# EAGLE design PGTNX02_vca (EAGLE 8.5.2)
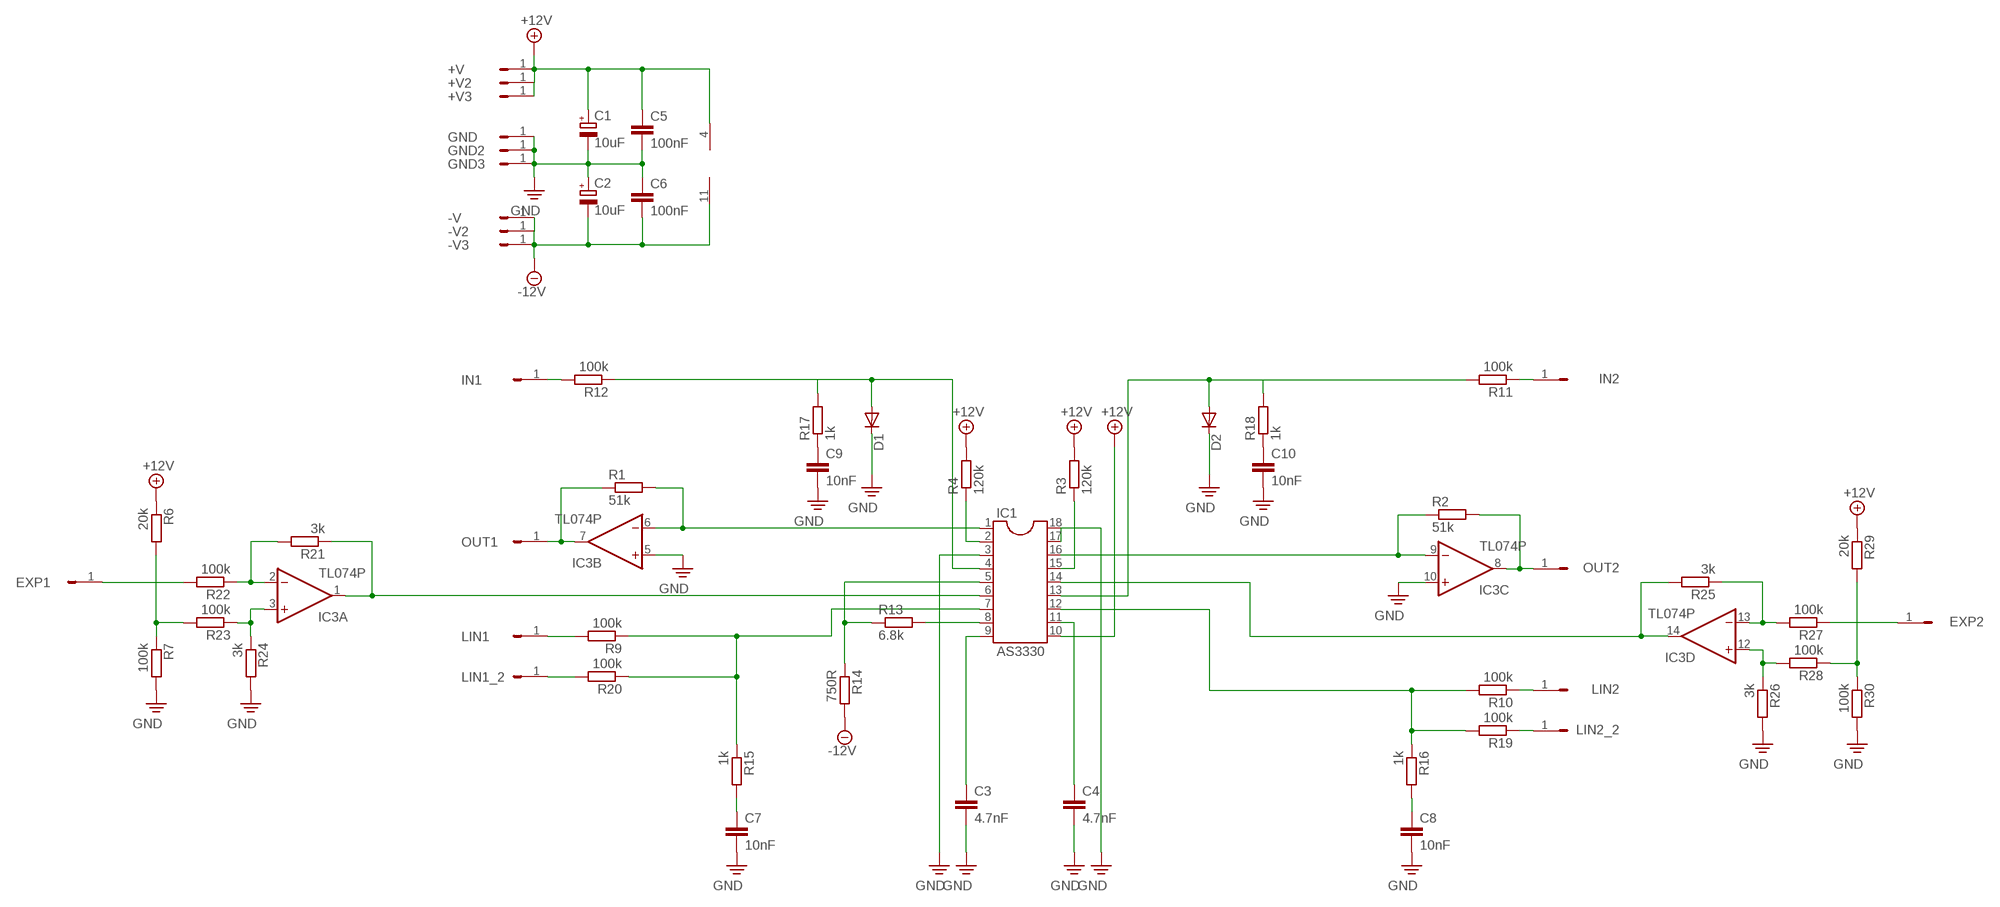
[diagram p0: schematic, sheet 1]

## Parts
+V  HEADER/MALE/01  [HEADER/MALE/01]
+V2  HEADER/MALE/01  [HEADER/MALE/01]
+V3  HEADER/MALE/01  [HEADER/MALE/01]
-V  HEADER/MALE/01  [HEADER/MALE/01]
-V2  HEADER/MALE/01  [HEADER/MALE/01]
-V3  HEADER/MALE/01  [HEADER/MALE/01]
C1  10uF  CAPACITOR/POLARIZEDE2.5-6  [E2,5-6]
C2  10uF  CAPACITOR/POLARIZEDE2.5-6  [E2,5-6]
C3  4.7nF  CAPACITORCERAMICDISC/5  [CERAMICDISC/5]
C4  4.7nF  CAPACITORCERAMICDISC/5  [CERAMICDISC/5]
C5  100nF  CAPACITORCERAMICDISC/5  [CERAMICDISC/5]
C6  100nF  CAPACITORCERAMICDISC/5  [CERAMICDISC/5]
C7  10nF  CAPACITORCERAMICDISC/5  [CERAMICDISC/5]
C8  10nF  CAPACITORCERAMICDISC/5  [CERAMICDISC/5]
C9  10nF  CAPACITORCERAMICDISC/5  [CERAMICDISC/5]
C10  10nF  CAPACITORCERAMICDISC/5  [CERAMICDISC/5]
D1  1N4148DO35-7  [DO35-7]
D2  1N4148DO35-7  [DO35-7]
EXP1  HEADER/MALE/01  [HEADER/MALE/01]
EXP2  HEADER/MALE/01  [HEADER/MALE/01]
GND  HEADER/MALE/01  [HEADER/MALE/01]
GND2  HEADER/MALE/01  [HEADER/MALE/01]
GND3  HEADER/MALE/01  [HEADER/MALE/01]
IC1  AS3330  DIL18  [DIL18]
IC3  TL074P  [DIL14]
IN1  HEADER/MALE/01  [HEADER/MALE/01]
IN2  HEADER/MALE/01  [HEADER/MALE/01]
LIN1  HEADER/MALE/01  [HEADER/MALE/01]
LIN1_2  HEADER/MALE/01  [HEADER/MALE/01]
LIN2  HEADER/MALE/01  [HEADER/MALE/01]
LIN2_2  HEADER/MALE/01  [HEADER/MALE/01]
OUT1  HEADER/MALE/01  [HEADER/MALE/01]
OUT2  HEADER/MALE/01  [HEADER/MALE/01]
R1  51k  RESISTORRESISTOR/UPRIGHT/7.5  [RESISTOR/7.5]
R2  51k  RESISTORRESISTOR/UPRIGHT/7.5  [RESISTOR/7.5]
R3  120k  RESISTORRESISTOR/UPRIGHT/7.5  [RESISTOR/7.5]
R4  120k  RESISTORRESISTOR/UPRIGHT/7.5  [RESISTOR/7.5]
R6  20k  RESISTORRESISTOR/UPRIGHT/7.5  [RESISTOR/7.5]
R7  100k  RESISTORRESISTOR/UPRIGHT/7.5  [RESISTOR/7.5]
R9  100k  RESISTORRESISTOR/UPRIGHT/7.5  [RESISTOR/7.5]
R10  100k  RESISTORRESISTOR/UPRIGHT/7.5  [RESISTOR/7.5]
R11  100k  RESISTORRESISTOR/UPRIGHT/7.5  [RESISTOR/7.5]
R12  100k  RESISTORRESISTOR/UPRIGHT/7.5  [RESISTOR/7.5]
R13  6.8k  RESISTORRESISTOR/UPRIGHT/7.5  [RESISTOR/7.5]
R14  750R  RESISTORRESISTOR/UPRIGHT/7.5  [RESISTOR/7.5]
R15  1k  RESISTORRESISTOR/UPRIGHT/7.5  [RESISTOR/7.5]
R16  1k  RESISTORRESISTOR/UPRIGHT/7.5  [RESISTOR/7.5]
R17  1k  RESISTORRESISTOR/UPRIGHT/7.5  [RESISTOR/7.5]
R18  1k  RESISTORRESISTOR/UPRIGHT/7.5  [RESISTOR/7.5]
R19  100k  RESISTORRESISTOR/UPRIGHT/7.5  [RESISTOR/7.5]
R20  100k  RESISTORRESISTOR/UPRIGHT/7.5  [RESISTOR/7.5]
R21  3k  RESISTORRESISTOR/UPRIGHT/7.5  [RESISTOR/7.5]
R22  100k  RESISTORRESISTOR/UPRIGHT/7.5  [RESISTOR/7.5]
R23  100k  RESISTORRESISTOR/UPRIGHT/7.5  [RESISTOR/7.5]
R24  3k  RESISTORRESISTOR/UPRIGHT/7.5  [RESISTOR/7.5]
R25  3k  RESISTORRESISTOR/UPRIGHT/7.5  [RESISTOR/7.5]
R26  3k  RESISTORRESISTOR/UPRIGHT/7.5  [RESISTOR/7.5]
R27  100k  RESISTORRESISTOR/UPRIGHT/7.5  [RESISTOR/7.5]
R28  100k  RESISTORRESISTOR/UPRIGHT/7.5  [RESISTOR/7.5]
R29  20k  RESISTORRESISTOR/UPRIGHT/7.5  [RESISTOR/7.5]
R30  100k  RESISTORRESISTOR/UPRIGHT/7.5  [RESISTOR/7.5]

## Nets
+12V: +V2.1 +V3.1 +V.1 C1.+ C5.1 IC1.10 IC3.4(P:V+) R3.2 R4.2 R6.1 R29.1
-12V: -V2.1 -V3.1 -V.1 C2.- C6.2 IC3.11(P:V-) R14.2
N$1: IC1.1 IC3.6(B:-IN) R1.2
N$2: IC3.7(B:OUT) OUT1.1 R1.1
N$3: IC1.16 IC3.9(C:-IN) R2.1
N$4: IC3.8(C:OUT) OUT2.1 R2.2
N$5: C4.1 IC1.11
N$6: IC1.15 R3.1
N$7: IC1.2 R4.1
N$8: C3.1 IC1.9
N$9: IC1.14 IC3.14(D:OUT) R25.2
N$10: IC1.6 IC3.1(A:OUT) R21.1
N$11: EXP1.1 R22.2
N$12: EXP2.1 R27.1
N$13: IC1.7 R9.1 R15.1 R20.1
N$14: IC1.12 R10.2 R16.1 R19.2
N$15: LIN2.1 R10.1
N$16: LIN1.1 R9.2
N$17: D2.A IC1.13 R11.2 R18.2
N$18: D1.A IC1.4 R12.1 R17.2
N$19: IN1.1 R12.2
N$20: IN2.1 R11.1
N$21: IC1.5 R13.1 R14.1
N$22: IC1.8 R13.2
N$23: C7.1 R15.2
N$24: C8.1 R16.2
N$25: C9.1 R17.1
N$26: C10.1 R18.1
N$27: LIN1_2.1 R20.2
N$28: LIN2_2.1 R19.1
N$29: R6.2 R7.1 R23.2
N$30: IC3.2(A:-IN) R21.2 R22.1
N$31: IC3.3(A:+IN) R23.1 R24.1
N$32: IC3.13(D:-IN) R25.1 R27.2
N$34: IC3.12(D:+IN) R26.1 R28.2
N$35: R28.1 R29.2 R30.1
PE: C1.- C2.+ C3.2 C4.2 C5.2 C6.1 C7.2 C8.2 C9.2 C10.2 D1.C D2.C GND2.1 GND3.1 GND.1 IC1.3 IC1.17 IC1.18 IC3.5(B:+IN) IC3.10(C:+IN) R7.2 R24.2 R26.2 R30.2 ; supply symbol labelled GND

## Library data of the parts
+V +V2 +V3 -V -V2 -V3 GND GND2 GND3 = connectors:HEADER/MALE/01; SPICEPREFIX: X
C1 C2 = capacitors:CAPACITOR/POLARIZED: POLARIZED CAPACITOR, European symbol; SPICEPREFIX: C
C3-C10 = capacitors:CAPACITOR: CAPACITOR, European symbol
D1 D2 = transistors:1N4148: DIODE high speed (Philips)
EXP1 EXP2 IN1 IN2 LIN1 LIN1_2 LIN2 LIN2_2 OUT1 OUT2 = connectors:HEADER/MALE/01
IC1 = ic_package:DIL18: Dual In Line / Socket
IC3 = ic_analogue:TL074: OP AMP
R1-R4 R6 R7 R9-R30 = resistors:RESISTOR: RESISTOR, European symbol

## Board
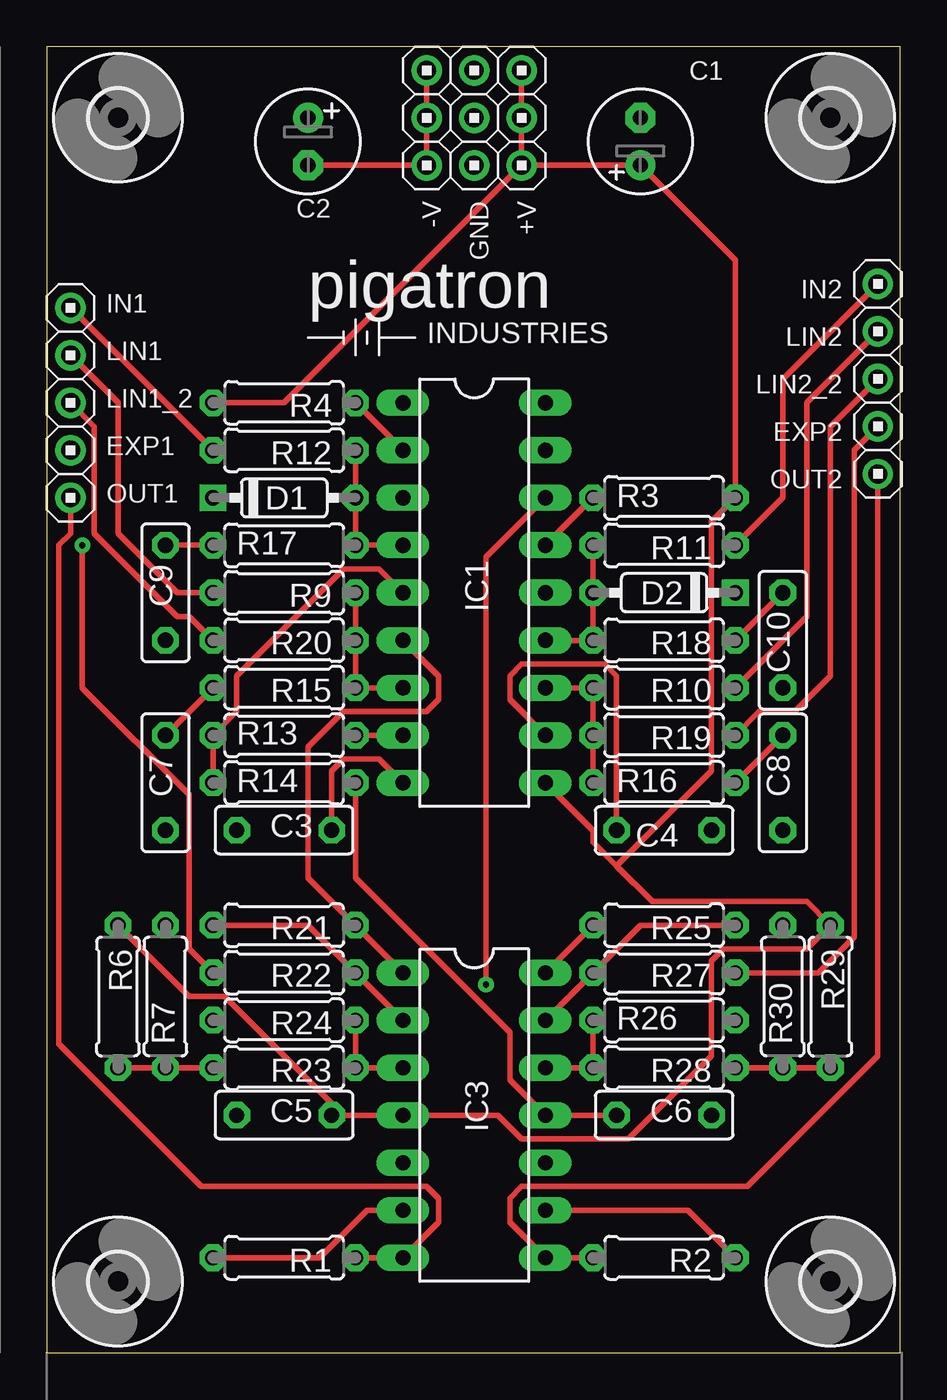
[diagram p1: board, top side]
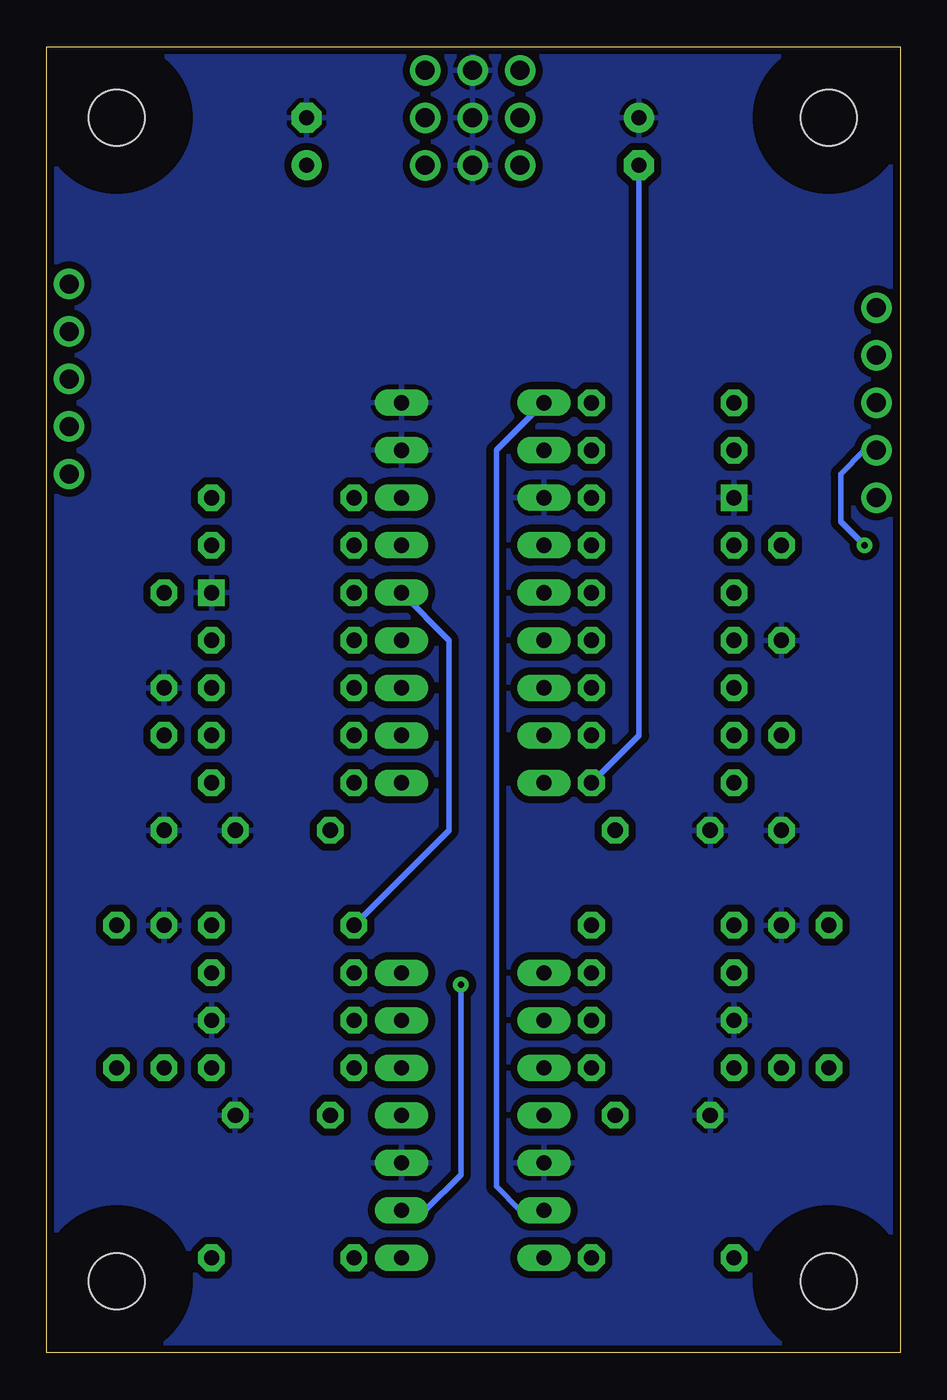
[diagram p2: board, bottom side, seen from below]

Size 45.64 x 69.84 mm. Coordinates in mm from the lower left corner, seen from the top.
Outline: 0,0 45.64,0 45.64,69.84 0,69.84 0,0
Copper layers (1*16): Top 0.0356mm / dielectric 1.5011mm / Bottom 0.0356mm
Design rules "pigatron": minimum track width 12mil, minimum drill 13mil, track to track 15mil, track to pad 10mil, pad to pad 10mil, via to via 10mil, smd to smd 6mil, copper to edge 15mil, drill to drill 10mil, minimum pad ring 12mil, minimum via ring 10mil, stop-mask expansion 4mil, vias tented up to drill 0mil, thermal gap 10mil

### Footprints (pad centres in the part's own frame; a part is rotated, then mirrored left to right if it is on the bottom)
HEADER/MALE/01 = drill 1.016: 1 0,0
E2,5-6 = drill 0.813 pad 1.6: + -1.27,0 | drill 0.813 pad 1.6 octagon: - 1.27,0
CERAMICDISC/5 = drill 0.813 octagon: 1 -2.54,0; 2 2.54,0
DO35-7 = drill 0.813 octagon: A 3.81,0 | drill 0.813 square: C -3.81,0
DIL18 = drill 0.813 long: 1 -10.16,-3.81; 2 -7.62,-3.81; 3 -5.08,-3.81; 4 -2.54,-3.81; 5 0,-3.81; 6 2.54,-3.81; 7 5.08,-3.81; 8 7.62,-3.81; 9 10.16,-3.81; 10 10.16,3.81; 11 7.62,3.81; 12 5.08,3.81; 13 2.54,3.81; 14 0,3.81; 15 -2.54,3.81; 16 -5.08,3.81; 17 -7.62,3.81; 18 -10.16,3.81
DIL14 = drill 0.813 long: 1 -7.62,-3.81; 2 -5.08,-3.81; 3 -2.54,-3.81; 4 0,-3.81; 5 2.54,-3.81; 6 5.08,-3.81; 7 7.62,-3.81; 8 7.62,3.81; 9 5.08,3.81; 10 2.54,3.81; 11 0,3.81; 12 -2.54,3.81; 13 -5.08,3.81; 14 -7.62,3.81
RESISTOR/7.5 = drill 0.813 octagon: 1 -3.81,0; 2 3.81,0
STANDOFF/3.0 = hole 3: 0,0

### Placement (x,y rotation side)
+V  25.4,63.5 270 top
+V2  25.4,66.04 270 top
+V3  25.4,68.58 270 top
-V  20.32,63.5 270 top
-V2  20.32,66.04 270 top
-V3  20.32,68.58 270 top
C1  31.75,64.77 90 top
C2  13.97,64.77 270 top
C3  12.7,27.94 180 top
C4  33.02,27.94 0 top
C5  12.7,12.7 180 top
C6  33.02,12.7 180 top
C7  6.35,30.48 270 top
C8  39.37,30.48 270 top
C9  6.35,40.64 270 top
C10  39.37,38.1 270 top
D1  12.7,45.72 0 top
D2  33.02,40.64 180 top
EXP1  1.27,48.26 0 top
EXP2  44.45,49.53 180 top
GND  22.86,63.5 270 top
GND2  22.86,68.58 270 top
GND3  22.86,66.04 270 top
IC1  22.86,40.64 270 top
IC3  22.86,12.7 270 top
IN1  1.27,55.88 0 top
IN2  44.45,57.15 180 top
LIN1  1.27,53.34 0 top
LIN1_2  1.27,50.8 0 top
LIN2  44.45,54.61 180 top
LIN2_2  44.45,52.07 180 top
OUT1  1.27,45.72 0 top
OUT2  44.45,46.99 180 top
R1  12.7,5.08 180 top
R2  33.02,5.08 180 top
R3  33.02,45.72 0 top
R4  12.7,50.8 180 top
R6  3.81,19.05 270 top
R7  6.35,19.05 90 top
R9  12.7,40.64 180 top
R10  33.02,35.56 180 top
R11  33.02,43.18 180 top
R12  12.7,48.26 180 top
R13  12.7,33.02 0 top
R14  12.7,30.48 0 top
R15  12.7,35.56 180 top
R16  33.02,30.48 0 top
R17  12.7,43.18 0 top
R18  33.02,38.1 180 top
R19  33.02,33.02 180 top
R20  12.7,38.1 180 top
R21  12.7,22.86 180 top
R22  12.7,20.32 180 top
R23  12.7,15.24 180 top
R24  12.7,17.78 180 top
R25  33.02,22.86 180 top
R26  33.02,17.78 0 top
R27  33.02,20.32 180 top
R28  33.02,15.24 180 top
R29  41.91,19.05 270 top
R30  39.37,19.05 90 top
U$1  [STANDOFF/3.0]  3.81,3.81 0 top
U$2  [STANDOFF/3.0]  41.91,3.81 0 top
U$3  [STANDOFF/3.0]  3.81,66.04 0 top
U$4  [STANDOFF/3.0]  41.91,66.04 0 top
U$5  [PIGATRON-LOGO]  22.86,55.88 0 top

### Tracks (layer width: path | path; a pad name or v marks a point on that pad's centre or on a via)
+12V
  Top 0.305: +V3.1 +V2.1 +V.1 | R4.2 12.7,50.8 +V.1 | 15.88,12.7 IC3.4 24.13,12.7 25.4,11.43 31.11,11.43 35.56,15.88 35.56,20.95 36.2,21.59 40.64,21.59 R29.1 40.64,24.13 32.38,24.13 30.48,26.04 | R6.1 7.62,19.05 9.53,19.05 15.88,12.7 | 15.88,12.7 C5.1 | IC1.10 29.21,27.94 29.21,27.3 30.48,26.04 | 30.48,26.04 35.56,31.11 35.56,44.45 R3.2 36.83,58.42 C1.+ +V.1
-12V
  Top 0.305: -V3.1 -V2.1 -V.1 C2.- | C6.2 IC3.11 24.77,14.61 24.77,17.14 16.51,25.4 R14.2
  Bottom 0.305: C2.- 13.97,33.02 R14.2
N$1
  Top 0.305: R1.2 14.61,5.08 17.14,7.62 IC3.6
  Bottom 0.305: IC1.1 21.59,48.26 21.59,8.89 20.32,7.62 IC3.6
N$2
  Top 0.305: R1.1 IC3.7 20.95,6.99 20.95,8.26 20.32,8.89 8.26,8.89 0.64,16.51 0.64,43.18 1.27,43.81 OUT1.1
N$3  (via drill 0.33)
  Top 0.305: IC3.9 34.29,7.62 R2.1 | IC1.16 23.5,42.55 v23.5,19.68
  Bottom 0.305: v23.5,19.68 23.5,9.53 25.4,7.62 IC3.9
N$4
  Top 0.305: R2.2 IC3.8 24.77,6.99 24.77,8.26 25.4,8.89 37.47,8.89 44.45,15.88 OUT2.1
N$5
  Top 0.305: IC1.11 24.77,34.92 24.77,36.2 25.4,36.83 29.84,36.83 30.48,36.2 C4.1
N$6
  Top 0.305: R3.1 IC1.15
N$7
  Top 0.305: IC1.2 R4.1
N$8
  Top 0.305: C3.1 15.24,31.11 15.88,31.75 17.78,31.75 IC1.9
N$9
  Top 0.305: R25.2 IC3.14
  Bottom 0.305: IC1.14 24.13,38.1 24.13,27.94 R25.2
N$10
  Top 0.305: IC3.1 R21.1 13.97,25.4 13.97,32.38 15.88,34.29 20.32,34.29 20.95,34.92 20.95,36.2 IC1.6
N$11  (via drill 0.33)
  Top 0.305: R22.2 7.62,21.59 7.62,29.84 1.91,35.56 v1.91,43.18
  Bottom 0.305: v1.91,43.18 3.17,44.45 3.17,46.99 1.91,48.26 EXP1.1
N$12
  Top 0.305: R27.1 41.27,20.32 43.18,22.23 43.18,48.26 EXP2.1
N$13
  Top 0.305: IC1.7 R15.1 R20.1 R9.1
N$14
  Top 0.305: R16.1 R19.2 R10.2 IC1.12
N$15
  Top 0.305: R10.1 40.64,39.37 40.64,50.8 LIN2.1
N$16
  Top 0.305: R9.2 6.99,40.64 3.81,43.81 3.81,50.8 LIN1.1
N$17
  Top 0.305: IC1.13 R18.2 D2.A R11.2
N$18
  Top 0.305: IC1.4 R17.2 D1.A R12.1
N$19
  Top 0.305: IN1.1 R12.2
N$20
  Top 0.305: R11.1 39.37,45.72 39.37,52.07 IN2.1
N$21
  Top 0.305: R14.1 R13.1 10.16,34.29 10.16,36.2 15.88,41.91 17.78,41.91 IC1.5
N$22
  Top 0.305: IC1.8 R13.2
N$23
  Top 0.305: R15.2 C7.1
N$24
  Top 0.305: C8.1 R16.2
N$25
  Top 0.305: R17.1 C9.1
N$26
  Top 0.305: C10.1 R18.1
N$27
  Top 0.305: R20.2 7.62,39.37 6.99,39.37 2.54,43.81 2.54,49.53 LIN1_2.1
N$28
  Top 0.305: R19.1 38.1,34.29 40.01,34.29 41.91,36.2 41.91,49.53 LIN2_2.1
N$29
  Top 0.305: R6.2 R7.1 R23.2
N$30
  Top 0.305: R21.2 13.97,22.86 R22.1 IC3.2
N$31
  Top 0.305: R24.1 R23.1 IC3.3
N$32
  Top 0.305: IC3.13 R27.2 31.75,22.86 R25.1
N$34
  Top 0.305: IC3.12 R28.2 R26.1
N$35
  Top 0.305: R28.1 R30.1 R29.2
PE
  pour Bottom: 0,69.85 0,0 45.72,0 45.72,69.85

### Text on the board
tDocu: Rob Ellis 2020 | PGTNX02 | VC AMPLIFIER